# Altium project SkinHearing_electrodes.PrjPcb
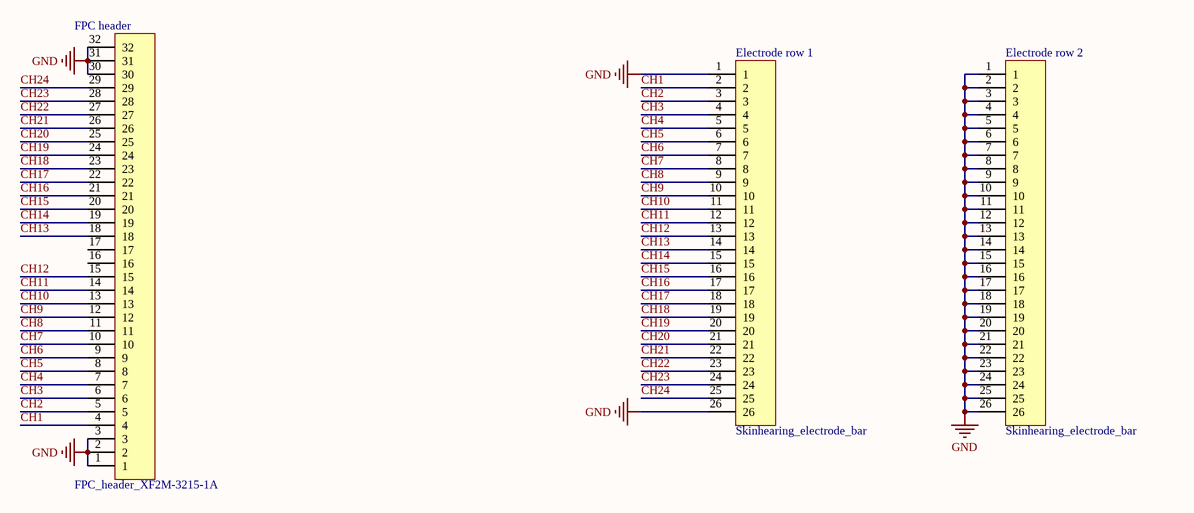
[diagram p0: SkinHearing_electrodes.SchDoc]
1 sheet, 3 parts. Net scope: global (net labels, ports and power ports of the same name join across sheets).
Board file: SkinHearing_electrodes.PcbDoc

## Sheet SkinHearing_electrodes.SchDoc
size A4

### Parts
Electrode_row_1  Skinhearing_electrode_bar  [Skinhearing_electrode bar]
Electrode_row_2  Skinhearing_electrode_bar  [Skinhearing_electrode bar]
FPC_header  FPC_header_XF2M-3215-1A  [FPC_XF2M-3215-1A]

### Nets
GND: Electrode_row_1.1 Electrode_row_1.26 Electrode_row_2.1 Electrode_row_2.2 Electrode_row_2.3 Electrode_row_2.4 Electrode_row_2.5 Electrode_row_2.6 Electrode_row_2.7 Electrode_row_2.8 Electrode_row_2.9 Electrode_row_2.10 Electrode_row_2.11 Electrode_row_2.12 Electrode_row_2.13 Electrode_row_2.14 Electrode_row_2.15 Electrode_row_2.16 Electrode_row_2.17 Electrode_row_2.18 Electrode_row_2.19 Electrode_row_2.20 Electrode_row_2.21 Electrode_row_2.22 Electrode_row_2.23 Electrode_row_2.24 Electrode_row_2.25 Electrode_row_2.26 FPC_header.1 FPC_header.2 FPC_header.3 FPC_header.30 FPC_header.31 FPC_header.32
CH1: Electrode_row_1.2 FPC_header.4
CH2: Electrode_row_1.3 FPC_header.5
CH3: Electrode_row_1.4 FPC_header.6
CH4: Electrode_row_1.5 FPC_header.7
CH5: Electrode_row_1.6 FPC_header.8
CH6: Electrode_row_1.7 FPC_header.9
CH7: Electrode_row_1.8 FPC_header.10
CH8: Electrode_row_1.9 FPC_header.11
CH9: Electrode_row_1.10 FPC_header.12
CH10: Electrode_row_1.11 FPC_header.13
CH11: Electrode_row_1.12 FPC_header.14
CH12: Electrode_row_1.13 FPC_header.15
CH13: Electrode_row_1.14 FPC_header.18
CH14: Electrode_row_1.15 FPC_header.19
CH15: Electrode_row_1.16 FPC_header.20
CH16: Electrode_row_1.17 FPC_header.21
CH17: Electrode_row_1.18 FPC_header.22
CH18: Electrode_row_1.19 FPC_header.23
CH19: Electrode_row_1.20 FPC_header.24
CH20: Electrode_row_1.21 FPC_header.25
CH21: Electrode_row_1.22 FPC_header.26
CH22: Electrode_row_1.23 FPC_header.27
CH23: Electrode_row_1.24 FPC_header.28
CH24: Electrode_row_1.25 FPC_header.29

Not connected (* = marked no-connect by the designer): FPC_header 16 17